# Altium schematic sheet Acionadores e Atuadores.SchDoc
size B
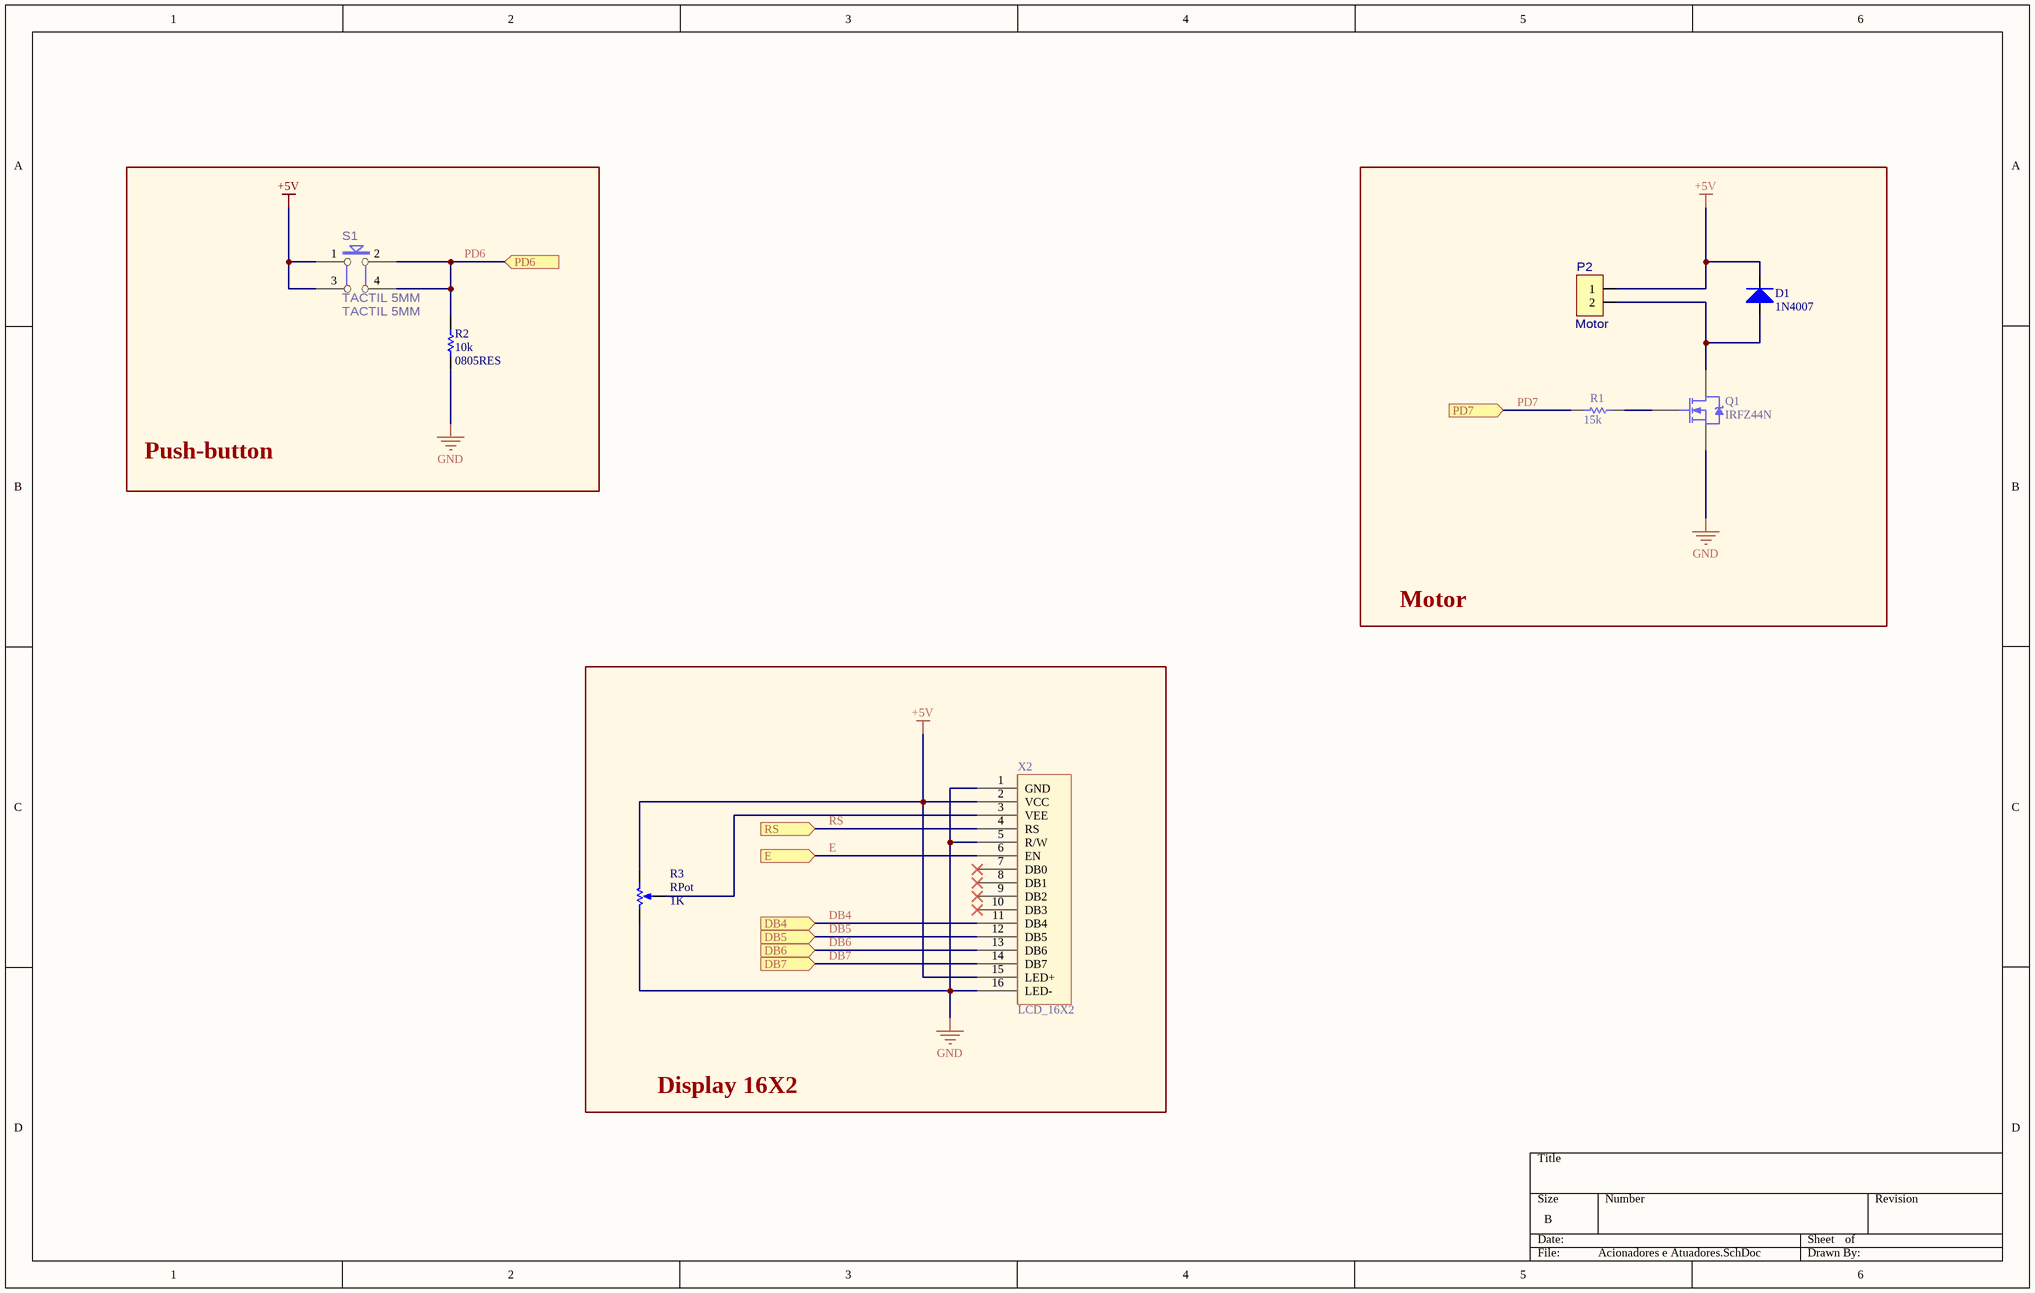
[diagram p0: Acionadores e Atuadores.SchDoc]

## Parts
D1  1N4007  [SOD123 - duplicate]
P2  Footprint: Motor  [KRE-2]  (hidden comment: KRE-2)
Q1  IRFZ44N  [D2PAK_N]
R1  15k  [0805RES]
R2  10k  [0805RES]
R3  RPot  value 1K  [Pot]
S1  TACTIL 5MM  [TACTIL 5MM - duplicate]
X2  LCD_16X2  [LCD16X2]

## Blocks framed on the sheet
Push-button: R2 S1
Motor: D1 P2 Q1 R1
Display 16X2: R3 X2

## Ports
DB4 (in), DB5 (in), DB6 (in), DB7 (in), E (in), PD6 (in), PD7 (in), RS (in)

## Nets
+5V: D1.2(K) P2.1 R3.1(TOP) S1.1 S1.3 X2.2(VCC) X2.15(LED+)
GND: Q1.3(S) R2.1 R3.2(BOT) X2.1(GND) X2.5(R/W) X2.16(LED-)
DB4: X2.11(DB4) ; port DB4
DB5: X2.12(DB5) ; port DB5
DB6: X2.13(DB6) ; port DB6
DB7: X2.14(DB7) ; port DB7
E: X2.6(EN) ; port E
PD6: R2.2 S1.2 S1.4 ; port PD6
PD7: R1.1 ; port PD7
RS: X2.4(RS) ; port RS
NetD1_1: D1.1(A) P2.2 Q1.2(D)
NetQ1_1: Q1.1(G) R1.2
NetR3_3: R3.3(TAP) X2.3(VEE)

Not connected (* = marked no-connect by the designer): X2 7(DB0)* 8(DB1)* 9(DB2)* 10(DB3)*

## Library data of the parts
D1 = Diode: Default Diode
P2 = CON2_2_2: ClassName: Fonte2; ClassName: RELAY; Value: KRE-2
Q1 = IRF640S: HEXFET N-Channel Power MOSFET; PackageReference: D2PAK; Publisher: Altium Limited; ComponentLink1Description: Manufacturer Link; ComponentLink2Description: Datasheet
R1 R2 = Res1: Resistor
  R1: Value: 15k
  R2: Value: 10k
R3 = RPot: Potentiometer; Sim Note: Enter the Resistance value and the set point into parameter fields.; Set Position: 0.5; Published: 8-Jun-2000; LatestRevisionDate: 17-Jul-2002; LatestRevisionNote: Re-released for DXP Platform.; PackageReference: VR5; Publisher: Altium Limited; PackageDescription: Variable Resistor, Thru-Hole; 3 Leads
S1 = PUSH-BUTTON: ClassName: PUSH_BUTTON; Value: TACTIL 5MM; Footprint: TACTIL 5MM